# Altium schematic sheet STM32F1_CNC_SCHA.SchDoc: STM32F1_CNC_POWER
size A4; Revision: 1.0; SheetNumber: 1
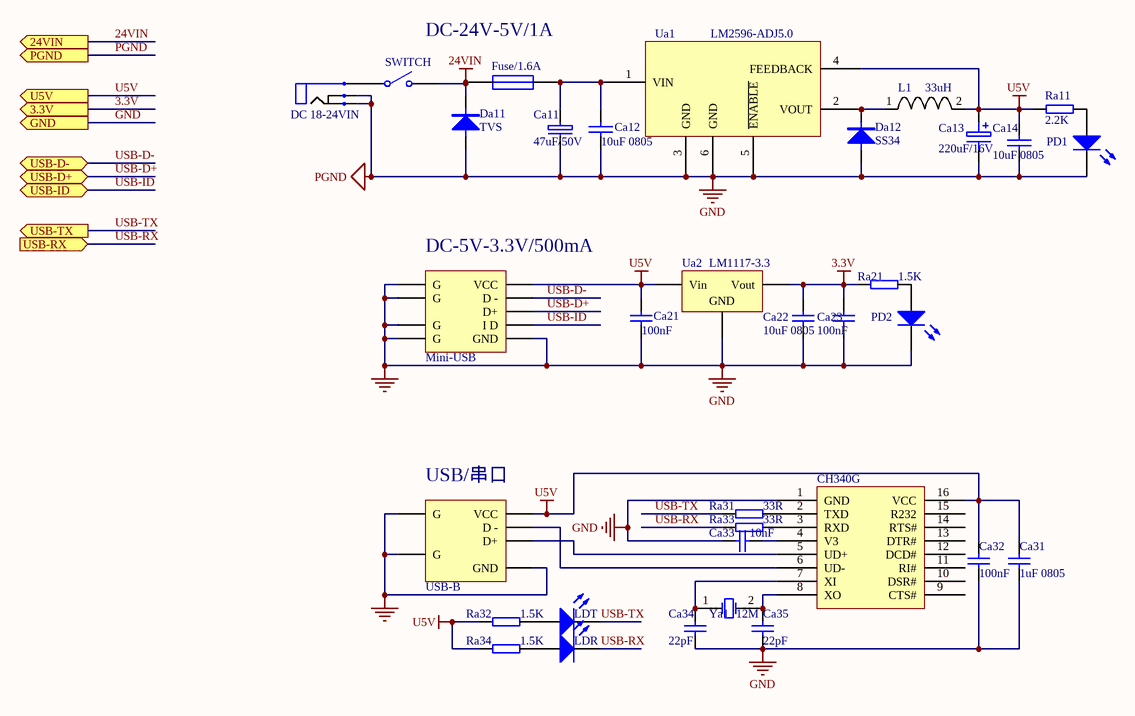
[diagram p0: STM32F1_CNC_SCHA.SchDoc]

## Parts
Ca11  47uF/50V  [SMD-EC-F6.3]
Ca12  10uF 0805  [0805]
Ca13  220uF/16V  [SMD-EC-F6.3]
Ca14  10uF 0805  [0805]
Ca21  100nF  [0805]
Ca22  10uF 0805  [0805]
Ca23  100nF  [0603]
Ca31  1uF 0805  [0805]
Ca32  100nF  [0603]
Ca33  10nF  [0603]
Ca34  22pF  [0603]
Ca35  22pF  [0603]
CH340G  CH340G  [SO-16]  (value not drawn)
Da11  TVS  [SMA]
Da12  SS34  [SMA]
DC_18-24VIN  DC  [DC-9V]  (value not drawn)
Fuse/1.6A  Fuse  [1812]  (value not drawn)
L1  33uH  [L]
LDR  LED  [LED-0805]  (value not drawn)
LDT  LED  [LED-0805]  (value not drawn)
Mini-USB  Mini-USB  [USB-mini-S]  (value not drawn)
PD1  LED  [LED-0805]  (value not drawn)
PD2  LED  [LED-0805]  (value not drawn)
Ra11  2.2K  [0805]
Ra21  1.5K  [0603]
Ra31  33R  [0603]
Ra32  1.5K  [0603]
Ra33  33R  [0603]
Ra34  1.5K  [0603]
SWITCH  SW-SPST  [SWTCH]  (value not drawn)
Ua1  LM2596-ADJ5.0  [LM2596S]
Ua2  LM1117-3.3  [SOT223]
USB-B  USB-B  [USB-B2]  (value not drawn)
Ya1  12M  [XTAL-3215-2P]

## Ports
3.3V (out), 24VIN (out), GND (out), PGND (out), U5V (out), USB-D+ (bidir), USB-D- (bidir), USB-ID (bidir), USB-RX (in), USB-TX (out)

## Nets
3.3V: Ca22.1 Ca23.2 Ra21.2 Ua2.2(Vout) ; port 3.3V
24VIN: Da11.2 Fuse/1.6A.1 SWITCH.1(NO) ; port 24VIN
GND: Ca11.2 Ca12.2 Ca13.2 Ca14.2 Ca21.1 Ca22.2 Ca23.1 Ca31.2 Ca32.2 Ca33.2 Ca34.1 Ca35.1 CH340G.1(GND) Da11.1 Da12.1 DC_18-24VIN.2 DC_18-24VIN.3 Mini-USB.0(G) Mini-USB.5(GND) PD1.2(K) PD2.2(K) Ua1.3(GND) Ua1.5(~{ENABLE}) Ua1.6(GND) Ua2.1(GND) USB-B.0(G) USB-B.4(GND) ; port PGND, port GND  [also labelled PGND]
U5V: Ca13.1 Ca14.1 Ca21.2 Ca31.1 Ca32.1 CH340G.16(VCC) L1.2 Mini-USB.1(VCC) Ra11.2 Ra32.2 Ra34.2 Ua1.4(FEEDBACK) Ua2.3(Vin) USB-B.1(VCC) ; port U5V
USB-D+: Mini-USB.3(D+) ; port USB-D+
USB-D-: Mini-USB.2(D_-) ; port USB-D-
USB-ID: Mini-USB.4(I_D) ; port USB-ID
USB-RX: LDR.2(K) Ra33.2 ; port USB-RX
USB-TX: LDT.2(K) Ra31.2 ; port USB-TX
NetCa11_1: Ca11.1 Ca12.1 Fuse/1.6A.2 Ua1.1(VIN)
NetCa33_1: Ca33.1 CH340G.4(V3)
NetCa34_2: Ca34.2 CH340G.7(XI) Ya1.1(OSC1)
NetCa35_2: Ca35.2 CH340G.8(XO) Ya1.2(OSC2)
NetCH340G_2: CH340G.2(TXD) Ra31.1
NetCH340G_3: CH340G.3(RXD) Ra33.1
NetCH340G_5: CH340G.5(UD+) USB-B.3(D+)
NetCH340G_6: CH340G.6(UD-) USB-B.2(D_-)
NetDa12_2: Da12.2 L1.1 Ua1.2(VOUT)
NetDC_18-24VIN_1: DC_18-24VIN.1 SWITCH.2(COMMON)
NetLDR_1: LDR.1(A) Ra34.1
NetLDT_1: LDT.1(A) Ra32.1
NetPD1_1: PD1.1(A) Ra11.1
NetPD2_1: PD2.1(A) Ra21.1

Not connected (* = marked no-connect by the designer): CH340G 9(CTS#) 10(DSR#) 11(RI#) 12(DCD#) 13(DTR#) 14(RTS#) 15(R232)

## Notes on the sheet
- DC-24V-5V/1A
- (near Mini-USB) DC-5V-3.3V/500mA
- (near USB-B) USB/串口

## Library data of the parts
Ca11 = EC1: Electro Capacitor
Ca12 Ca14 = CAP: Capacitor
Ca13 = ELECTR
Ca21 = CAP SMD 0603  X5R 1礔 25V 10%: 0603  X5R; Value: 1礔; Rated voltage: 25V; Tolerance: 10%; Manufacturer: *; Manufacturer P/N: *; Order code Farnell: 1288202RL; Power: *; Technology: X5R; Temperature  Factor: *; Temperature Max: +125癈; Temperature Min: -55癈; STS Code: *
Ca22 = CAP SMD 0603  X5R 1礔 25V 10%: 0603  X5R 1礔; Rated voltage: 25V; Tolerance: 10%; Manufacturer: *; Manufacturer P/N: *; Order code Farnell: 1288202RL; Value: 1礔; Power: *; Technology: X5R; Temperature  Factor: *; Temperature Max: +125癈; Temperature Min: -55癈; STS Code: *
Ca23 = Capacitor_ST: Capacitor 0402 / 0603 / 0805; Revision: July-2002: Re-released for DXP Platform.; Value: 100nF
Ca31-Ca35 = Cap: Capacitor; Published: 8-Jun-2000; LatestRevisionDate: 17-Jul-2002; LatestRevisionNote: Re-released for DXP Platform.; PackageReference: RAD-0.3; Publisher: Altium Limited; PackageDescription: Radial Cap, Thru-Hole; 2 Leads; 0.3 in Pin Spacing
  Ca31: Value: 1uF
  Ca32: Value: 100nF
  Ca33: Value: 10nF
  Ca34 Ca35: Value: 22pF
CH340G = Component_1
Da11 = DIODE: Low-Loss RF Switching Diode
Da12 = DIODE: D; value: ZM4733/5.1V,1W
DC_18-24VIN = DC-5.5mm
L1 = L
LDR LDT PD1 PD2 = LED2: Typical RED, GREEN, YELLOW, AMBER GaAs LED; Published: 8-Jun-2000; LatestRevisionDate: 17-Jul-2002; LatestRevisionNote: Re-released for DXP Platform.; PackageVersion: Feb-2002; PackageReference: 3.2X1.6X1.1; Publisher: Altium Limited; PackageDescription: SM LED; 2 Flat Leads
Mini-USB USB-B = Mini-USB_G
Ra11 Ra21 Ra31-Ra34 = RES1: Resister
SWITCH = SW-SPST: Single-Pole, Single-Throw Switch; Published: 24-Mar-1999; LatestRevisionDate: 17-Jul-2002; LatestRevisionNote: Re-released for DXP Platform.; PackageReference: SPST-2; Publisher: Altium Limited; PackageDescription: Switch; 2 Leads
Ua1 = LM2575
Ua2 = Volt Reg: Voltage Regulator; Published: 24-Mar-1999; LatestRevisionDate: 29-May-2009; LatestRevisionNote: IPC-7351 Footprint Added.; PackageReference: D2PAK; Publisher: Altium Limited; PackageDescription: 3-Pin Transistor Outline Package 2.54 mm Pitch, 15.1 mm Lead Span
Ya1 = XTAL: Crystal Oscillator; Published: 8-Jun-2000; LatestRevisionDate: 17-Jul-2002; LatestRevisionNote: Re-released for DXP Platform.; PackageReference: R38; Publisher: Altium Limited; PackageDescription: Crystal, Thru-Hole; 2 Leads; Body 3.1 x 8.2 mm (Dia.xH)